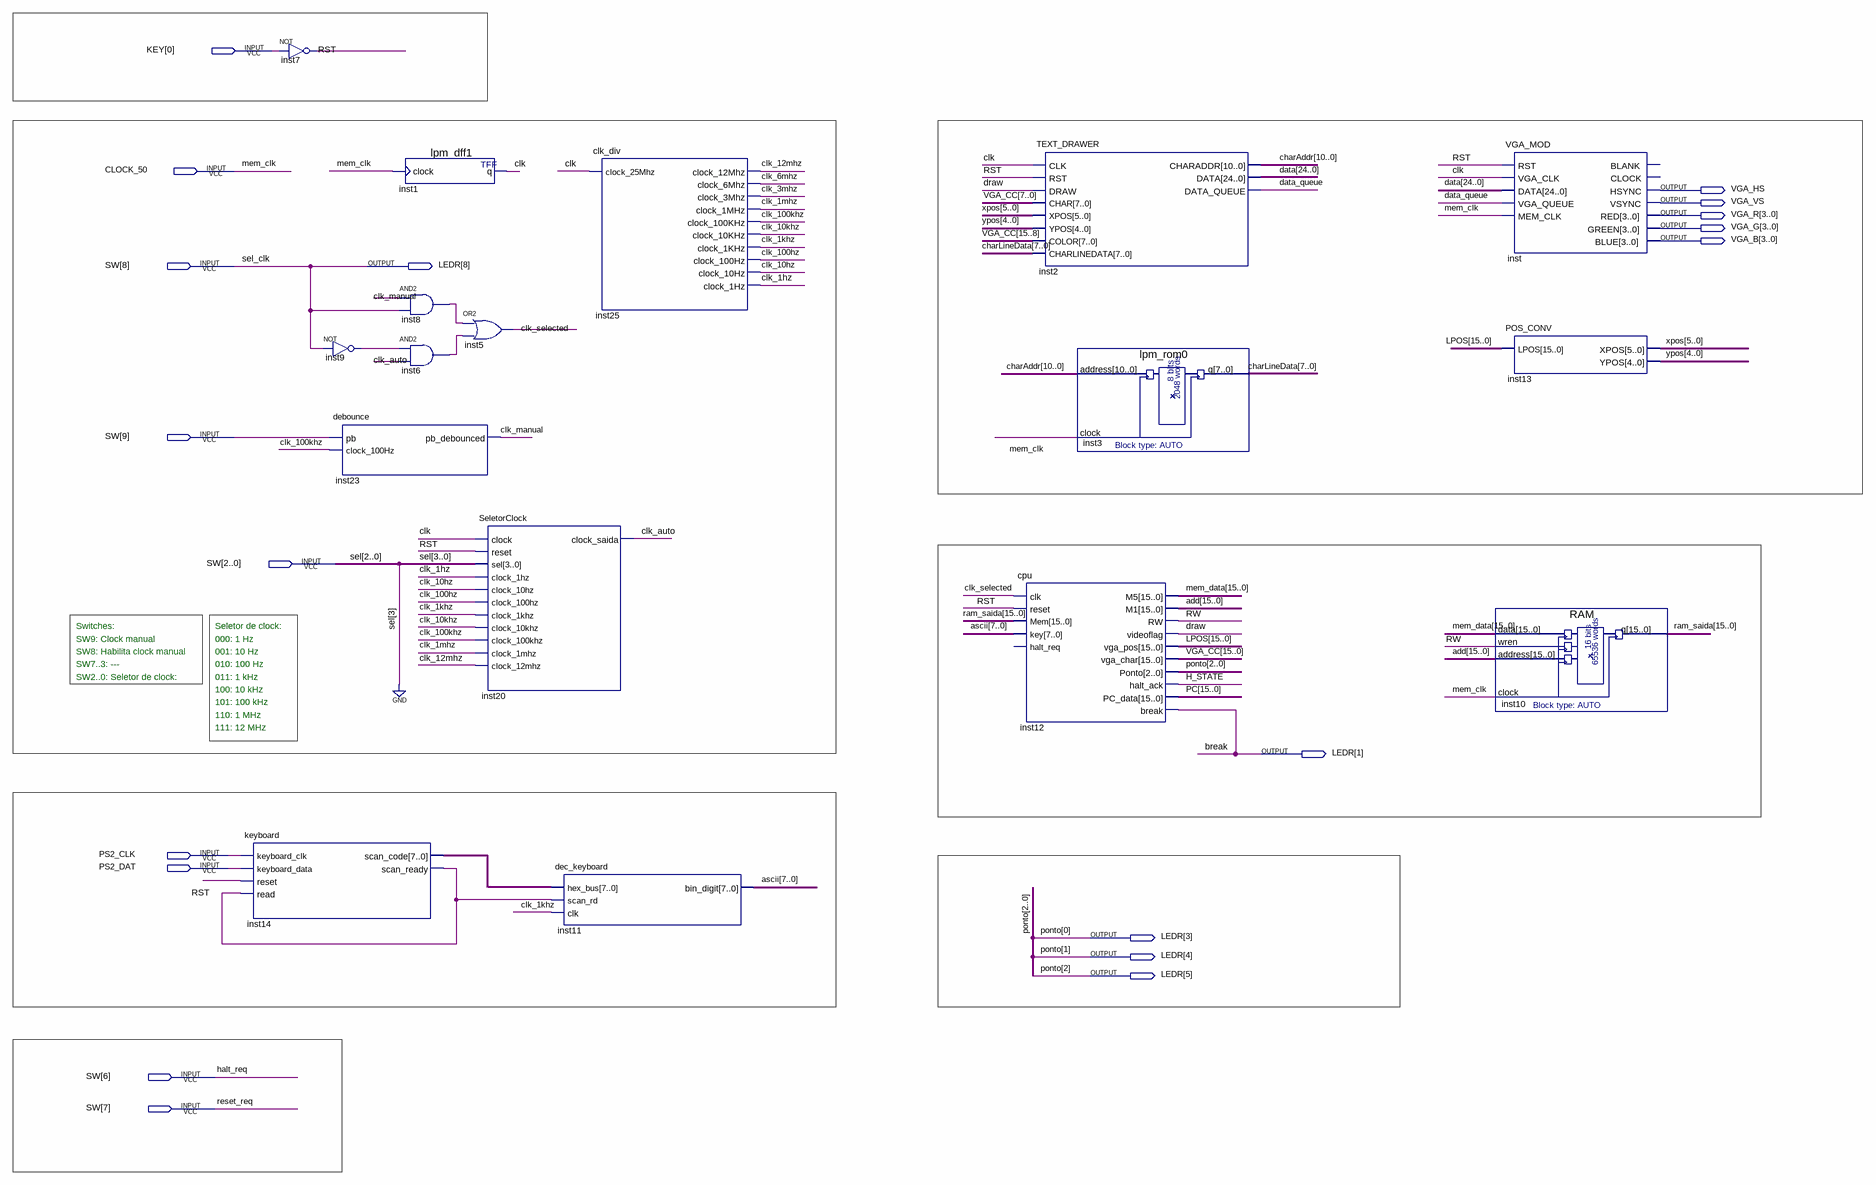
[diagram p0: schematic sheet]
// Quartus schematic AP9.bdf as structural Verilog: 17 symbols, 19 pins
module AP9 (
  input  [0:0] KEY,
  input  CLOCK_50,
  input  [9:0] SW,
  input  PS2_CLK,
  input  PS2_DAT,
  output VGA_HS,
  output VGA_VS,
  output [3:0] VGA_R,
  output [3:0] VGA_G,
  output [3:0] VGA_B,
  output [8:1] LEDR
);

  wire clk, clk_1hz, clk_1khz, clk_1mhz, clk_3mhz, clk_6mhz, clk_10hz, clk_10khz, clk_12mhz, clk_100hz,
       clk_100khz, clk_auto, clk_manual, clk_selected, data_queue, draw, H_STATE, inst6_out, inst8_out,
       inst9_out, inst14_scan_ready, RST, RW;
  wire [4:0] ypos;
  wire [5:0] xpos;
  wire [7:0] ascii, charLineData, inst14_scan_code;
  wire [10:0] charAddr;
  wire [15:0] add, LPOS, mem_data, PC, ram_saida, VGA_CC;
  wire [24:0] data;

  keyboard inst14 (
    .keyboard_clk(PS2_CLK), .keyboard_data(PS2_DAT), .reset(RST), .read(inst14_scan_ready),
    .scan_code(inst14_scan_code), .scan_ready(inst14_scan_ready));
  not inst7 (RST, KEY[0]);
  not inst9 (inst9_out, SW[8]);
  debounce inst23 (.pb(SW[9]), .clock_100Hz(clk_100khz), .pb_debounced(clk_manual));
  lpm_dff1 inst1 (.clock(CLOCK_50), .q(clk));
  and inst8 (inst8_out, clk_manual, SW[8]);
  and inst6 (inst6_out, inst9_out, clk_auto);
  or inst5 (clk_selected, inst8_out, inst6_out);
  SeletorClock inst20 (
    .clock(clk), .reset(RST), .sel({1'b0, SW[2:0]}), .clock_1hz(clk_1hz), .clock_10hz(clk_10hz),
    .clock_100hz(clk_100hz), .clock_1khz(clk_1khz), .clock_10khz(clk_10khz), .clock_100khz(clk_100khz),
    .clock_1mhz(clk_1mhz), .clock_12mhz(clk_12mhz), .clock_saida(clk_auto));
  dec_keyboard inst11 (.hex_bus(inst14_scan_code), .scan_rd(inst14_scan_ready), .clk(clk_1khz), .bin_digit(ascii));
  clk_div inst25 (
    .clock_25Mhz(clk), .clock_12Mhz(clk_12mhz), .clock_6Mhz(clk_6mhz), .clock_3Mhz(clk_3mhz),
    .clock_1MHz(clk_1mhz), .clock_100KHz(clk_100khz), .clock_10KHz(clk_10khz), .clock_1KHz(clk_1khz),
    .clock_100Hz(clk_100hz), .clock_10Hz(clk_10hz), .clock_1Hz(clk_1hz));
  cpu inst12 (
    .clk(clk_selected), .reset(RST), .Mem(ram_saida), .key(ascii), .M5(mem_data), .M1(add), .RW(RW),
    .videoflag(draw), .vga_pos(LPOS), .vga_char(VGA_CC), .Ponto(LEDR[5:3]), .halt_ack(H_STATE), .PC_data(PC),
    .\break (LEDR[1]));  // open: halt_req
  TEXT_DRAWER inst2 (
    .CLK(clk), .RST(RST), .DRAW(draw), .CHAR(VGA_CC[7:0]), .XPOS(xpos), .YPOS(ypos), .COLOR(VGA_CC[15:8]),
    .CHARLINEDATA(charLineData), .CHARADDR(charAddr), .DATA(data), .DATA_QUEUE(data_queue));
  lpm_rom0 inst3 (.address(charAddr), .clock(CLOCK_50), .q(charLineData));
  VGA_MOD inst (
    .RST(RST), .VGA_CLK(clk), .DATA(data), .VGA_QUEUE(data_queue), .MEM_CLK(CLOCK_50), .HSYNC(VGA_HS),
    .VSYNC(VGA_VS), .RED(VGA_R), .GREEN(VGA_G), .BLUE(VGA_B));  // open: BLANK, CLOCK
  POS_CONV inst13 (.LPOS(LPOS), .XPOS(xpos), .YPOS(ypos));
  RAM inst10 (.data(mem_data), .wren(RW), .address(add), .clock(CLOCK_50), .q(ram_saida));

  assign LEDR[8] = SW[8];

  // Other names for the same wires on the sheet: break = LEDR[1]; halt_req = SW[6]; mem_clk = CLOCK_50;
  //   ponto[2:0] = LEDR[5:3]; reset_req = SW[7]; sel[2:0] = SW[2:0]; sel_clk = SW[8]

  // Notes on the sheet:
  //   Switches:
  //   Seletor de clock:
  //   SW9: Clock manual
  //   000: 1 Hz
  //   SW8: Habilita clock manual
  //   001: 10 Hz
  //   SW7..3: ---
  //   010: 100 Hz
  //   SW2..0: Seletor de clock:
  //   011: 1 kHz
  //   100: 10 kHz
  //   101: 100 kHz
  //   110: 1 MHz
  //   111: 12 MHz
endmodule
